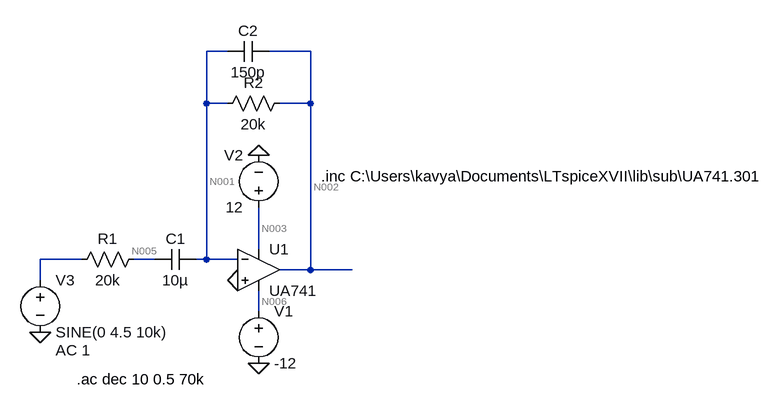
[diagram p0: schematic filter.asc]
filter.asc, the LTspice schematic file:
Version 4
SHEET 1 1104 680
WIRE 192 -144 160 -144
WIRE 320 -144 256 -144
WIRE 160 -64 160 -144
WIRE 192 -64 160 -64
WIRE 320 -64 320 -144
WIRE 320 -64 272 -64
WIRE 240 160 240 96
WIRE -32 176 -96 176
WIRE 80 176 48 176
WIRE 160 176 160 -64
WIRE 160 176 144 176
WIRE 208 176 160 176
WIRE 320 192 320 -64
WIRE 320 192 272 192
WIRE 384 192 320 192
WIRE -96 208 -96 176
WIRE 240 256 240 224
FLAG 240 16 0
FLAG 240 336 0
FLAG -96 288 0
FLAG 208 208 0
SYMBOL OpAmps\\opamp2 240 128 R0
SYMATTR InstName U1
SYMATTR Value UA741
SYMBOL voltage 240 240 R0
WINDOW 123 0 0 Left 0
WINDOW 39 0 0 Left 0
SYMATTR InstName V1
SYMATTR Value -12
SYMBOL voltage 240 112 R180
WINDOW 0 24 96 Left 2
WINDOW 3 24 16 Left 2
WINDOW 123 0 0 Left 0
WINDOW 39 0 0 Left 0
SYMATTR InstName V2
SYMATTR Value 12
SYMBOL voltage -96 192 R0
WINDOW 123 24 124 Left 2
WINDOW 39 0 0 Left 0
SYMATTR Value2 AC 1
SYMATTR InstName V3
SYMATTR Value SINE(0 4.5 10k)
SYMBOL res 64 160 R90
WINDOW 0 0 56 VBottom 2
WINDOW 3 32 56 VTop 2
SYMATTR InstName R1
SYMATTR Value 20k
SYMBOL cap 144 160 R90
WINDOW 0 0 32 VBottom 2
WINDOW 3 32 32 VTop 2
SYMATTR InstName C1
SYMATTR Value 10µ
SYMBOL cap 256 -160 R90
WINDOW 0 0 32 VBottom 2
WINDOW 3 32 32 VTop 2
SYMATTR InstName C2
SYMATTR Value 150p
SYMBOL res 288 -80 R90
WINDOW 0 0 56 VBottom 2
WINDOW 3 32 56 VTop 2
SYMATTR InstName R2
SYMATTR Value 20k
TEXT 336 48 Left 2 !.inc C:\\Users\\kavya\\Documents\\LTspiceXVII\\lib\\sub\\UA741.301
TEXT -40 360 Left 2 !.ac dec 10 0.5 70k

The netlist it stands for:
* filter.asc
XU1 0 N001 N003 N006 N002 UA741  ; pins In+ In- V+ V- OUT
V1 N006 0 -12
V2 N003 0 12
V3 N004 0 SINE(0 4.5 10k) AC 1
R1 N005 N004 20k
C1 N001 N005 10µ
C2 N002 N001 150p
R2 N002 N001 20k
.inc C:\Users\kavya\Documents\LTspiceXVII\lib\sub\UA741.301
.ac dec 10 0.5 70k
.backanno
.end

* Results of the author's LTspice run, read from the files saved beside the schematic
* Operating Point, zero values left out:
*   V(n002) = 1.606 mV
*   V(n006) = -12 V
*   V(n003) = 12 V
*   V(n001) = 11.18 µV
*   I(R2) = 79.76 nA
*   I(V2) = -1.335 mA
*   I(V1) = 1.335 mA
*   Ix(u1:1) = 79.74 nA
*   Ix(u1:2) = 79.76 nA
*   Ix(u1:3) = 1.335 mA
*   Ix(u1:4) = -1.335 mA
*   Ix(u1:5) = -79.76 nA
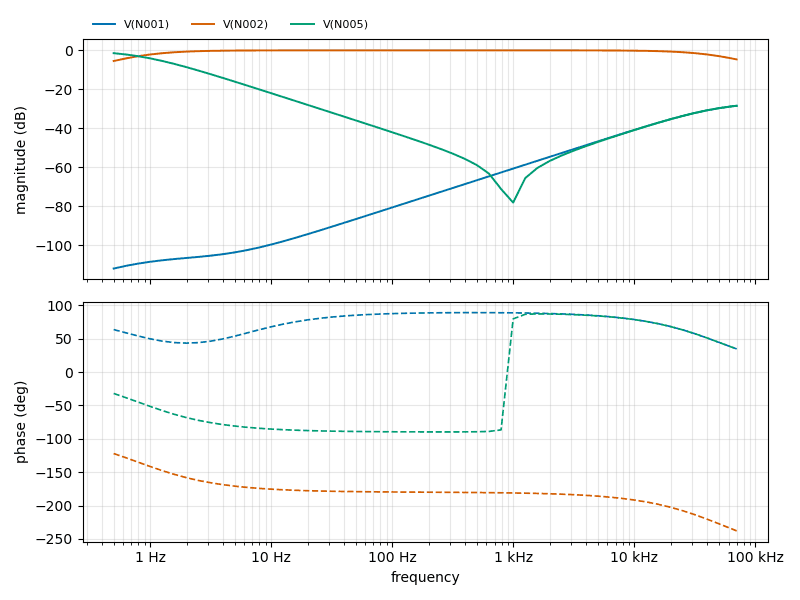
[diagram p1: AC Analysis of filter.asc, plotted from the saved traces]
* AC Analysis, 1 run:
*   V(N001): -112.08 dB at 500 mHz, -28.46 dB at 70 kHz, peak -28.46 dB at 70 kHz, 3 dB below the peak at 35.53 kHz
*   V(N002): -5.48 dB at 500 mHz, -4.65 dB at 70 kHz, peak -0.00 dB at 199.1 Hz, 3 dB below the peak at 796.2 mHz and 50.48 kHz
*   V(N005): -1.45 dB at 500 mHz, -28.46 dB at 70 kHz, peak -1.45 dB at 500 mHz, 3 dB below the peak at 1.061 Hz